# Altium schematic sheet Sheet1.SchDoc
size A4
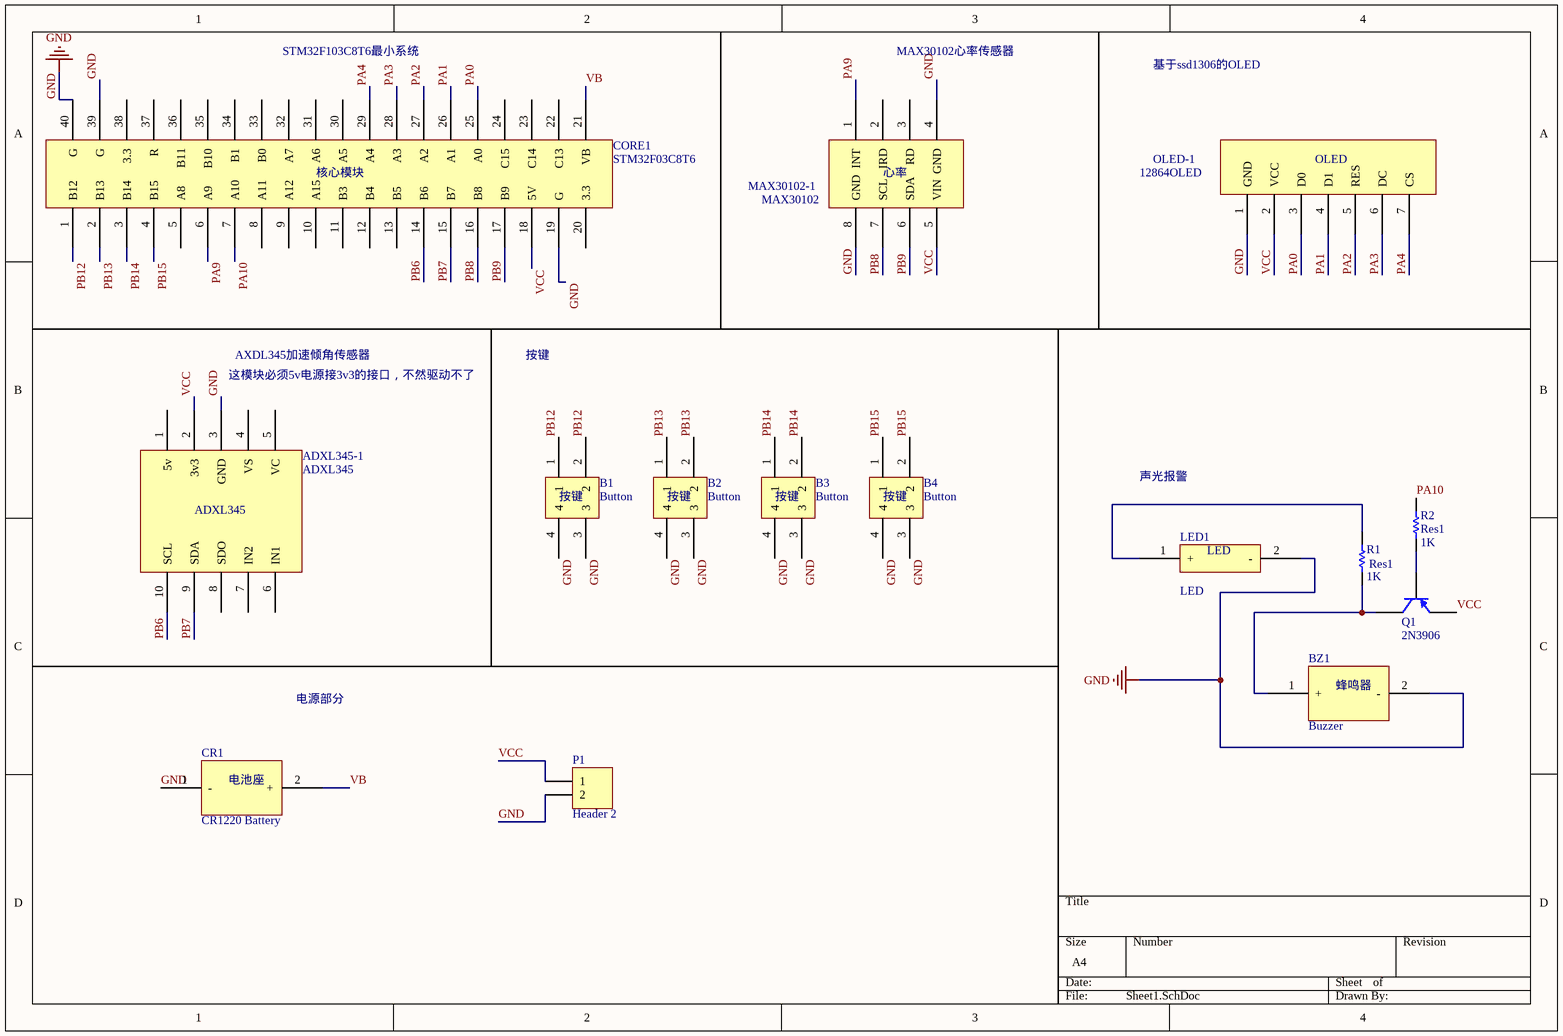
[diagram p0: Sheet1.SchDoc]

## Parts
ADXL345-1  ADXL345  [ADXL345]
B1  Button  [Button]
B2  Button  [Button]
B3  Button  [Button]
B4  Button  [Button]
BZ1  Buzzer  [Buzzer]
CORE1  STM32F03C8T6  [STM32F103C8T6]
CR1  CR1220 Battery  [CR1220 Battery]
LED1  LED  [LED]
MAX30102-1  MAX30102  [MAX30102]
OLED-1  12864OLED  [OLED]
P1  Header 2  [HDR1X2]
Q1  2N3906  [TO-92A]
R1  Res1  value 1K  [AXIAL-0.3]
R2  Res1  value 1K  [AXIAL-0.3]

## Nets
GND: ADXL345-1.3(GND) B1.3 B1.4 B2.3 B2.4 B3.3 B3.4 B4.3 B4.4 BZ1.2(-) CORE1.19(G) CORE1.39(G) CORE1.40(G) CR1.1(-) LED1.2(-) MAX30102-1.4(GND) MAX30102-1.8(GND) OLED-1.1(GND) P1.2
PA0: CORE1.25(A0) OLED-1.3(D0)
PA1: CORE1.26(A1) OLED-1.4(D1)
PA2: CORE1.27(A2) OLED-1.5(RES)
PA3: CORE1.28(A3) OLED-1.6(DC)
PA4: CORE1.29(A4) OLED-1.7(CS)
PA9: CORE1.6(A9) MAX30102-1.1(INT)
PA10: CORE1.7(A10) R2.2
PB6: ADXL345-1.10(SCL) CORE1.14(B6)
PB7: ADXL345-1.9(SDA) CORE1.15(B7)
PB8: CORE1.16(B8) MAX30102-1.7(SCL)
PB9: CORE1.17(B9) MAX30102-1.6(SDA)
PB12: B1.1 B1.2 CORE1.1(B12)
PB13: B2.1 B2.2 CORE1.2(B13)
PB14: B3.1 B3.2 CORE1.3(B14)
PB15: B4.1 B4.2 CORE1.4(B15)
VB: CORE1.21(VB) CR1.2(+)
VCC: ADXL345-1.2(3v3) CORE1.18(5V) MAX30102-1.5(VIN) OLED-1.2(VCC) P1.1 Q1.1(E)
NetBZ1_1: BZ1.1(+) Q1.3(C) R1.1
NetLED1_1: LED1.1(+) R1.2
NetQ1_2: Q1.2(B) R2.1

Not connected (* = marked no-connect by the designer): ADXL345-1 1(5v) 4(VS) 5(VC) 6(IN1) 7(IN2) 8(SDO); CORE1 5(A8) 8(A11) 9(A12) 10(A15) 11(B3) 12(B4) 13(B5) 20(3.3) 22(C13) 23(C14) 24(C15) 30(A5) 31(A6) 32(A7) 33(B0) 34(B1) 35(B10) 36(B11) 37(R) 38(3.3); MAX30102-1 2(IRD) 3(RD)

## Notes on the sheet
- STM32F103C8T6最小系统
- MAX30102心率传感器
- 基于ssd1306的OLED
- 这模块必须5v电源接3v3的接口，不然驱动不了
- AXDL345加速倾角传感器
- 按键
- 声光报警
- 电源部分
- (in symbol 12864OLED) OLED
- (in symbol Button) 按键
- (in symbol Buzzer) 蜂鸣器
- (in symbol CR1220 Battery) 电池座
- (in symbol MAX30102) 心率
- (in symbol STM32F03C8T6) 核心模块

## Library data of the parts
P1 = Header 2: Header, 2-Pin; LatestRevisionDate: 17-Jul-2002; LatestRevisionNote: Re-released for DXP Platform.; Publisher: Altium Limited
Q1 = 2N3906: PNP General Purpose Amplifier; Published: 8-Jun-2000; LatestRevisionDate: 15-Jan-2003; LatestRevisionNote: PCB Footprint 'BCY-W3/D4.7' replaced; PackageReference: TO-92A; Publisher: Altium Limited; ComponentLink1Description: Manufacturer Link; ComponentLink1URL: http://www.fairchildsemi.com/; ComponentLink2Description: Datasheet; ComponentLink2URL: http://www.fairchildsemi.com/ds/2N%2F2N3906.pdf; DatasheetVersion: 1997; PackageVersion: Sep-1998; PackageDescription: TO, Flat Index; 3 In-Line, Axial Leads; Body Dia. 4.5mm; Leads 0.51 x 0.48 mm (max)
R1 R2 = Res1: Resistor; Published: 8-Jun-2000; LatestRevisionDate: 17-Jul-2002; LatestRevisionNote: Re-released for DXP Platform.; PackageReference: AXIAL-0.3; Publisher: Altium Limited; PackageDescription: Axial Device, Thru-Hole; 2 Leads; 0.3 in Pin Spacing